# Altium schematic sheet AMC_FMC_Carrier.SchDoc: AMC FMC Carrier v4
size 420 x 297 mm; Organization: WUT ISE; Address1: Warsaw University of Technology; Address2: Nowowiejska 15/19 00-665 Warsaw; Address3: t.przywozki@gmail.com; DocumentNumber: 1; Revision: 1; SheetNumber: 1; SheetTotal: 29; Project: AMC_FMC_Carrier v4.0.2; ModifiedBy: M. Biernat; CreateDate: XX/XX/XXXX; CheckedDate: -; Title2: Top; DivGrp: ISE; Designer: T.Przywozki
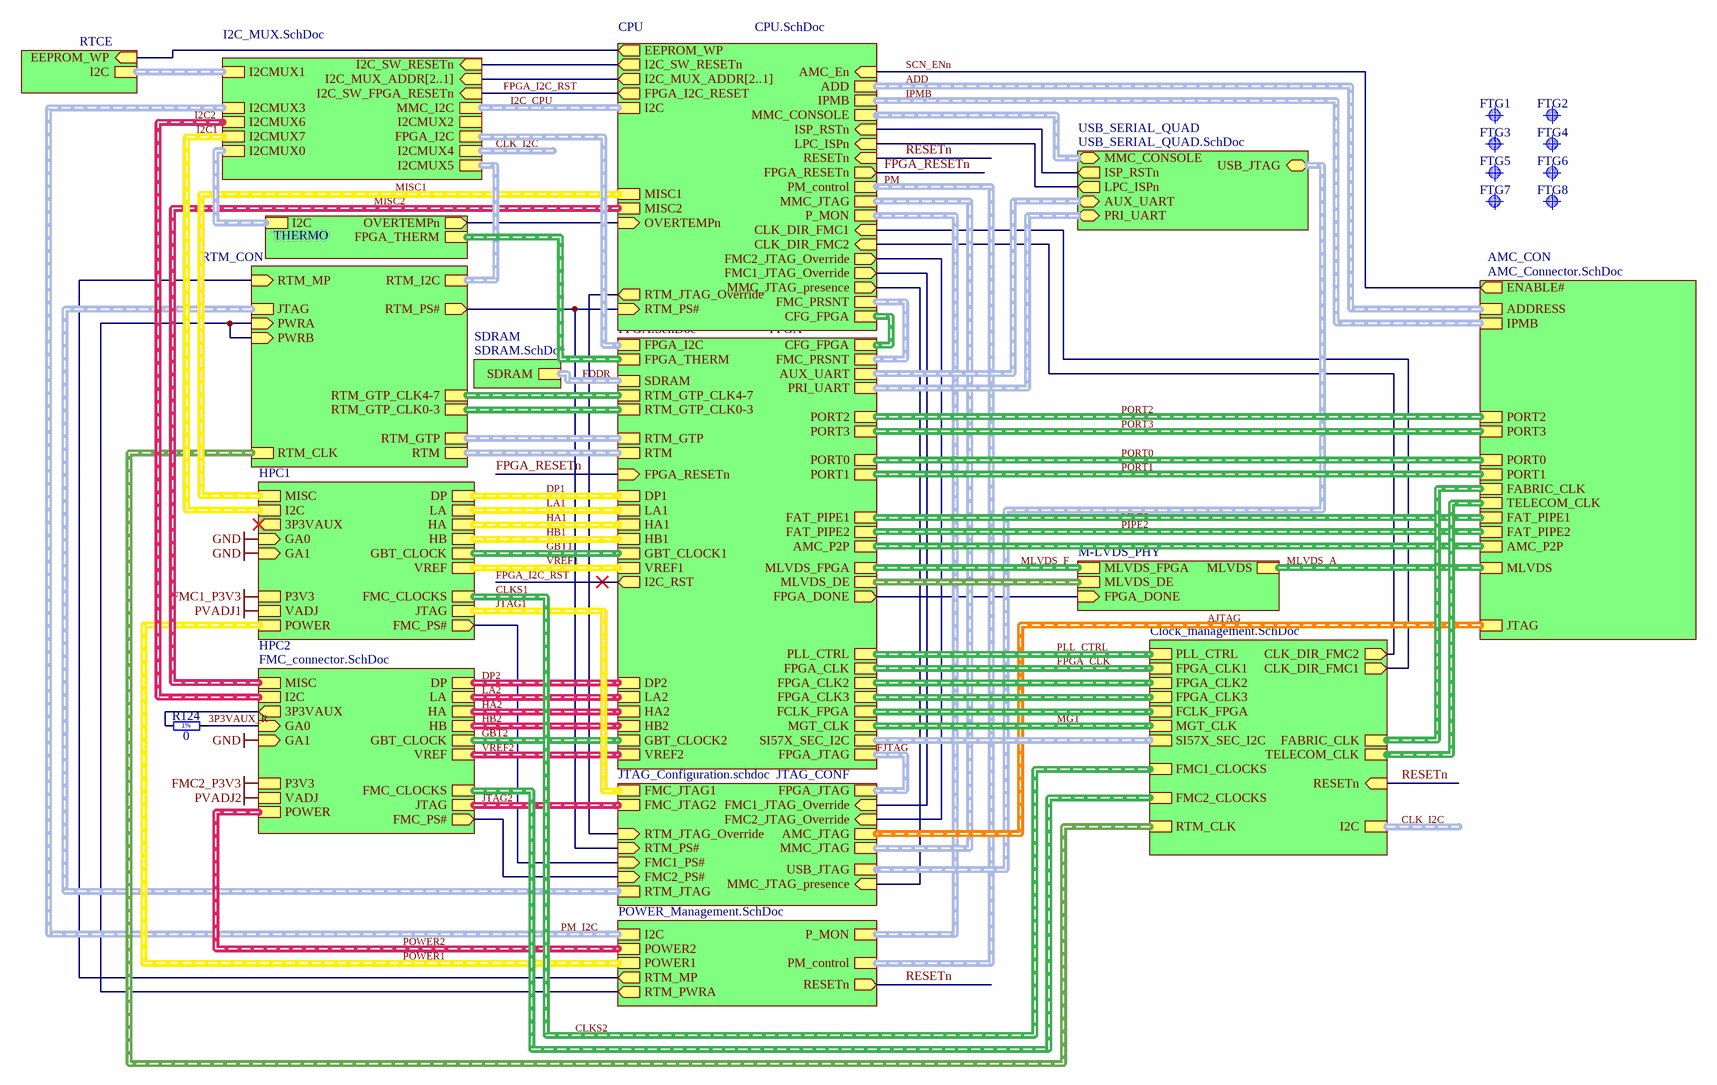
[diagram p0: AMC_FMC_Carrier.SchDoc]

## Parts
FTG1  Use only in PCB  [FIDUCIAL_TOP_S100-200]  (value not drawn)  (no BOM)
FTG2  Use only in PCB  [FIDUCIAL_TOP_C100-200]  (value not drawn)  (no BOM)
FTG3  Use only in PCB  [FIDUCIAL_TOP_S100-200]  (value not drawn)  (no BOM)
FTG4  Use only in PCB  [FIDUCIAL_TOP_C100-200]  (value not drawn)  (no BOM)
FTG5  Use only in PCB  [FIDUCIAL_TOP_S100-200]  (value not drawn)  (no BOM)
FTG6  Use only in PCB  [FIDUCIAL_TOP_C100-200]  (value not drawn)  (no BOM)
FTG7  Use only in PCB  [FIDUCIAL_TOP_S100-200]  (value not drawn)  (no BOM)
FTG8  Use only in PCB  [FIDUCIAL_TOP_C100-200]  (value not drawn)  (no BOM)
R124  0  [RESC1005X40N]

## Sub-sheets
AMC_CON = AMC_Connector.SchDoc: JTAG (harness AMC_JTAG), TELECOM_CLK (harness AMC_TELECOM_CLOCK), ADDRESS (harness AMC_ADD), FABRIC_CLK (harness AMC_FABRIC_CLOCK), IPMB (harness I2C), ENABLE# (out), PORT0 (harness PORT0), PORT1 (harness PORT1), PORT2 (harness PORT2), PORT3 (harness PORT3), FAT_PIPE1 (harness FAT_PIPE1), FAT_PIPE2 (harness FAT_PIPE2), MLVDS (harness MLVDS), AMC_P2P (harness AMC_P2P)
CLK_MGT = Clock_management.SchDoc: FABRIC_CLK (harness AMC_FABRIC_CLOCK), TELECOM_CLK (harness AMC_TELECOM_CLOCK), FMC1_CLOCKS (harness FMC_CLOCKS), FMC2_CLOCKS (harness FMC_CLOCKS), MGT_CLK (harness MGT_CLK), FPGA_CLK1 (harness FPGA_SDRAM_CLK), PLL_CTRL (harness PLL_CTRL), RESETn (in), I2C (harness I2C), SI57X_SEC_I2C (harness SI57X_SEC_I2C), RTM_CLK (harness RTM_CLK), FPGA_CLK2 (harness FPGA_CLK), FPGA_CLK3 (harness FPGA_CLK), CLK_DIR_FMC2 (out), CLK_DIR_FMC1 (out), FCLK_FPGA (harness FPGA_CLK)
CPU = CPU.SchDoc: AMC_En (in), PM_control (harness PM_control), OVERTEMPn (in), CFG_FPGA (harness FPGA_CFG), RESETn (in), I2C (harness I2C), IPMB (harness I2C), MISC1 (harness MISC), MISC2 (harness MISC), ADD (harness AMC_ADD), FPGA_RESETn (out), RTM_PS# (in), I2C_SW_RESETn (out), RTM_JTAG_Override (out), FMC1_JTAG_Override (out), FMC2_JTAG_Override (out), MMC_JTAG (harness JTAG), ISP_RSTn (in), LPC_ISPn (in), MMC_CONSOLE (harness UART), I2C_MUX_ADDR[2..1] (out), P_MON (harness P_MON), EEPROM_WP (out), FMC_PRSNT (harness FMC_PRSNT), FPGA_I2C_RESET (out), CLK_DIR_FMC2 (in), CLK_DIR_FMC1 (in), MMC_JTAG_presence (out)
FPGA = FPGA.SchDoc: SDRAM (harness DDR), FPGA_JTAG (harness JTAG), VREF2 (harness FMC_J1_VREF), VREF1 (harness FMC_J1_VREF), FPGA_THERM (harness FPGA_THERM), CFG_FPGA (harness FPGA_CFG), FAT_PIPE1, FAT_PIPE2, PORT1 (harness PORT1), PORT0 (harness PORT0), MLVDS_FPGA (harness MLVDS-FPGA), GBT_CLOCK1, GBT_CLOCK2, MGT_CLK, FPGA_CLK, PLL_CTRL (harness PLL_CTRL), FPGA_RESETn (in), LA1, HA1, HB1, LA2, HA2, HB2, DP1, DP2, PORT2 (harness PORT2), PORT3 (harness PORT3), RTM_GTP (harness RTM_GTP), RTM_GTP_CLK4-7 (harness CLK_DIFF), RTM_GTP_CLK0-3 (harness CLK_DIFF), AMC_P2P (harness AMC_P2P), FPGA_I2C (harness I2C), SI57X_SEC_I2C (harness SI57X_SEC_I2C), PRI_UART (harness UART), RTM (harness RTM), I2C_RST (out), AUX_UART (harness UART), FPGA_DONE (out), FPGA_CLK2 (harness FPGA_CLK), FPGA_CLK3 (harness FPGA_CLK), FMC_PRSNT (harness FMC_PRSNT), MLVDS_DE (harness MLVDS_DE), FCLK_FPGA (harness FPGA_CLK)
HPC1 = FMC_connector.SchDoc: DP (harness FMC_J1_DP), LA (harness FMC_J1_LA), HA (harness FMC_J1_HA), HB (harness FMC_J1_HB), MISC (harness MISC), POWER (harness FMC_J1_POWER), JTAG (harness JTAG), I2C (harness I2C), GA0 (in), GA1 (in), 3P3VAUX (out), VREF (harness FMC_J1_VREF), FMC_CLOCKS (harness FMC_CLOCKS), GBT_CLOCK (harness GBT_CLOCK), VADJ, P3V3, FMC_PS# (out)
HPC2 = FMC_connector.SchDoc: DP (harness FMC_J1_DP), LA (harness FMC_J1_LA), HA (harness FMC_J1_HA), HB (harness FMC_J1_HB), MISC (harness MISC), POWER (harness FMC_J1_POWER), JTAG (harness JTAG), I2C (harness I2C), VREF (harness FMC_J1_VREF), GA0 (in), GA1 (in), 3P3VAUX (out), FMC_CLOCKS (harness FMC_CLOCKS), GBT_CLOCK (harness GBT_CLOCK), VADJ, P3V3, FMC_PS# (out)
I2C_MUX = I2C_MUX.SchDoc: I2CMUX0 (harness I2C), I2CMUX1 (harness I2C), I2CMUX3 (harness I2C), I2CMUX4 (harness I2C), I2C_SW_RESETn (in), MMC_I2C (harness I2C), I2CMUX7 (harness I2C), I2CMUX6 (harness I2C), I2CMUX5 (harness I2C), FPGA_I2C (harness I2C), I2C_MUX_ADDR[2..1] (in), I2C_SW_FPGA_RESETn (in), I2CMUX2 (harness I2C)
JTAG_CONF = JTAG_Configuration.schdoc: FMC_JTAG1 (harness JTAG), FMC_JTAG2 (harness JTAG), AMC_JTAG (harness AMC_JTAG), FPGA_JTAG (harness JTAG), RTM_JTAG (harness JTAG), FMC1_PS# (in), FMC2_PS# (in), MMC_JTAG (harness JTAG), USB_JTAG (harness USB_JTAG), RTM_PS# (in), RTM_JTAG_Override (in), FMC2_JTAG_Override (in), FMC1_JTAG_Override (in), MMC_JTAG_presence (in)
M-LVDS_PHY = M-LVDS PHY.SchDoc: MLVDS (harness MLVDS), MLVDS_FPGA (harness MLVDS-FPGA), FPGA_DONE (in), MLVDS_DE (harness MLVDS_DE)
PWR_MGT = POWER_Management.SchDoc: POWER1 (harness FMC_J1_POWER), POWER2 (harness FMC_J1_POWER), PM_control (harness PM_control), RESETn (out), I2C (harness I2C), RTM_MP (out), RTM_PWRA (out), P_MON (harness P_MON)
RTCE = RTCE.SchDoc: I2C (harness I2C), EEPROM_WP (in)
RTM_CON = RTM_CON.SchDoc: PWRA (in), PWRB (in), RTM_PS# (out), RTM_MP (in), RTM_GTP (harness RTM_GTP), JTAG (harness JTAG), RTM_GTP_CLK4-7 (harness CLK_DIFF), RTM_GTP_CLK0-3 (harness CLK_DIFF), RTM_CLK (harness RTM_CLK), RTM (harness RTM), RTM_I2C (harness I2C)
SDRAM = SDRAM.SchDoc: SDRAM (harness DDR)
THERMO = Thermometers.SchDoc: OVERTEMPn (out), FPGA_THERM (harness FPGA_THERM), I2C (harness I2C)
USB_SERIAL_QUAD = USB_SERIAL_QUAD.SchDoc: PRI_UART (bidir, harness UART), AUX_UART (bidir, harness UART), ISP_RSTn (out), LPC_ISPn (out), MMC_CONSOLE (bidir, harness UART), USB_JTAG (bidir, harness USB_JTAG)

## Nets
FMC1_P3V3: sheet HPC1/P3V3
FMC2_P3V3: sheet HPC2/P3V3
GND: sheet HPC1/GA0, sheet HPC1/GA1, sheet HPC2/GA1
PVADJ1: sheet HPC1/VADJ
PVADJ2: sheet HPC2/VADJ
3P3VAUX_R: R124.2 ; sheet HPC2/GA0
FPGA_I2C_RST: sheet FPGA/I2C_RST, sheet I2C_MUX/I2C_SW_FPGA_RESETn, sheet CPU/FPGA_I2C_RESET
FPGA_RESETn: sheet FPGA/FPGA_RESETn, sheet CPU/FPGA_RESETn
RESETn: sheet PWR_MGT/RESETn, sheet CLK_MGT/RESETn, sheet CPU/RESETn
SCN_ENn: sheet AMC_CON/ENABLE#, sheet CPU/AMC_En
NetR124_1: R124.1 ; sheet HPC2/3P3VAUX
(unnamed): sheet HPC1/FMC_PS#, sheet JTAG_CONF/FMC1_PS#
(unnamed): sheet HPC2/FMC_PS#, sheet JTAG_CONF/FMC2_PS#
(unnamed): sheet FPGA/FPGA_DONE, sheet M-LVDS_PHY/FPGA_DONE
(unnamed): sheet PWR_MGT/RTM_MP, sheet RTM_CON/RTM_MP
(unnamed): sheet PWR_MGT/RTM_PWRA, sheet RTM_CON/PWRA, sheet RTM_CON/PWRB
(unnamed): sheet JTAG_CONF/RTM_PS#, sheet RTM_CON/RTM_PS#, sheet CPU/RTM_PS#
(unnamed): sheet JTAG_CONF/RTM_JTAG_Override, sheet CPU/RTM_JTAG_Override
(unnamed): sheet JTAG_CONF/FMC2_JTAG_Override, sheet CPU/FMC2_JTAG_Override
(unnamed): sheet JTAG_CONF/FMC1_JTAG_Override, sheet CPU/FMC1_JTAG_Override
(unnamed): sheet JTAG_CONF/MMC_JTAG_presence, sheet CPU/MMC_JTAG_presence
(unnamed): sheet CLK_MGT/CLK_DIR_FMC2, sheet CPU/CLK_DIR_FMC2
(unnamed): sheet CLK_MGT/CLK_DIR_FMC1, sheet CPU/CLK_DIR_FMC1
(unnamed): sheet USB_SERIAL_QUAD/ISP_RSTn, sheet CPU/ISP_RSTn
(unnamed): sheet USB_SERIAL_QUAD/LPC_ISPn, sheet CPU/LPC_ISPn
(unnamed): sheet I2C_MUX/I2C_SW_RESETn, sheet CPU/I2C_SW_RESETn
(unnamed): sheet THERMO/OVERTEMPn, sheet CPU/OVERTEMPn
(unnamed): sheet RTCE/EEPROM_WP, sheet CPU/EEPROM_WP

## Buses and harness runs
bus sheet CPU/I2C_MUX_ADDR[2..1] = sheet I2C_MUX/I2C_MUX_ADDR[2..1]
harness ADD = sheet AMC_CON/ADDRESS = sheet CPU/ADD
harness AJTAG = sheet AMC_CON/JTAG = sheet JTAG_CONF/AMC_JTAG
harness CLK_I2C = sheet CLK_MGT/I2C
harness CLK_I2C = sheet I2C_MUX/I2CMUX4
harness CLKS1 = CLKS2 = sheet CLK_MGT/FMC1_CLOCKS = sheet HPC1/FMC_CLOCKS
harness DP1 = sheet FPGA/DP1 = sheet HPC1/DP
harness DP2 = sheet FPGA/DP2 = sheet HPC2/DP
harness FDDR = sheet FPGA/SDRAM = sheet SDRAM/SDRAM
harness FJTAG = sheet FPGA/FPGA_JTAG = sheet JTAG_CONF/FPGA_JTAG
harness FPGA_CLK = sheet CLK_MGT/FPGA_CLK1 = sheet FPGA/FPGA_CLK
harness GBT1 = sheet FPGA/GBT_CLOCK1 = sheet HPC1/GBT_CLOCK
harness GBT2 = sheet FPGA/GBT_CLOCK2 = sheet HPC2/GBT_CLOCK
harness HA1 = sheet FPGA/HA1 = sheet HPC1/HA
harness HA2 = sheet FPGA/HA2 = sheet HPC2/HA
harness HB1 = sheet FPGA/HB1 = sheet HPC1/HB
harness HB2 = sheet FPGA/HB2 = sheet HPC2/HB
harness I2C1 = sheet HPC1/I2C = sheet I2C_MUX/I2CMUX7
harness I2C2 = sheet HPC2/I2C = sheet I2C_MUX/I2CMUX6
harness I2C_CPU = sheet CPU/I2C = sheet I2C_MUX/MMC_I2C
harness IPMB = sheet AMC_CON/IPMB = sheet CPU/IPMB
harness JTAG1 = sheet HPC1/JTAG = sheet JTAG_CONF/FMC_JTAG1
harness JTAG2 = sheet HPC2/JTAG = sheet JTAG_CONF/FMC_JTAG2
harness LA1 = sheet FPGA/LA1 = sheet HPC1/LA
harness LA2 = sheet FPGA/LA2 = sheet HPC2/LA
harness MGT = sheet CLK_MGT/MGT_CLK = sheet FPGA/MGT_CLK
harness MISC1 = sheet CPU/MISC1 = sheet HPC1/MISC
harness MISC2 = sheet CPU/MISC2 = sheet HPC2/MISC
harness MLVDS_A = sheet AMC_CON/MLVDS = sheet M-LVDS_PHY/MLVDS
harness MLVDS_F = sheet FPGA/MLVDS_FPGA = sheet M-LVDS_PHY/MLVDS_FPGA
harness PIPE1 = sheet AMC_CON/FAT_PIPE1 = sheet FPGA/FAT_PIPE1
harness PIPE2 = sheet AMC_CON/FAT_PIPE2 = sheet FPGA/FAT_PIPE2
harness PLL_CTRL = sheet CLK_MGT/PLL_CTRL = sheet FPGA/PLL_CTRL
harness PM = sheet CPU/PM_control = sheet PWR_MGT/PM_control
harness PM_I2C = sheet I2C_MUX/I2CMUX3 = sheet PWR_MGT/I2C
harness PORT0 = sheet AMC_CON/PORT0 = sheet FPGA/PORT0
harness PORT1 = sheet AMC_CON/PORT1 = sheet FPGA/PORT1
harness PORT2 = sheet AMC_CON/PORT2 = sheet FPGA/PORT2
harness PORT3 = sheet AMC_CON/PORT3 = sheet FPGA/PORT3
harness POWER1 = sheet HPC1/POWER = sheet PWR_MGT/POWER1
harness POWER2 = sheet HPC2/POWER = sheet PWR_MGT/POWER2
harness sheet AMC_CON/AMC_P2P = sheet FPGA/AMC_P2P
harness sheet AMC_CON/FABRIC_CLK = sheet CLK_MGT/FABRIC_CLK
harness sheet AMC_CON/TELECOM_CLK = sheet CLK_MGT/TELECOM_CLK
harness sheet CLK_MGT/FCLK_FPGA = sheet FPGA/FCLK_FPGA
harness sheet CLK_MGT/FMC2_CLOCKS = sheet HPC2/FMC_CLOCKS
harness sheet CLK_MGT/FPGA_CLK2 = sheet FPGA/FPGA_CLK2
harness sheet CLK_MGT/FPGA_CLK3 = sheet FPGA/FPGA_CLK3
harness sheet CLK_MGT/RTM_CLK = sheet RTM_CON/RTM_CLK
harness sheet CLK_MGT/SI57X_SEC_I2C = sheet FPGA/SI57X_SEC_I2C
harness sheet CPU/CFG_FPGA = sheet FPGA/CFG_FPGA
harness sheet CPU/FMC_PRSNT = sheet FPGA/FMC_PRSNT
harness sheet CPU/MMC_CONSOLE = sheet USB_SERIAL_QUAD/MMC_CONSOLE
harness sheet CPU/MMC_JTAG = sheet JTAG_CONF/MMC_JTAG
harness sheet CPU/P_MON = sheet PWR_MGT/P_MON
harness sheet FPGA/AUX_UART = sheet USB_SERIAL_QUAD/AUX_UART
harness sheet FPGA/FPGA_I2C = sheet I2C_MUX/FPGA_I2C
harness sheet FPGA/FPGA_THERM = sheet THERMO/FPGA_THERM
harness sheet FPGA/MLVDS_DE = sheet M-LVDS_PHY/MLVDS_DE
harness sheet FPGA/PRI_UART = sheet USB_SERIAL_QUAD/PRI_UART
harness sheet FPGA/RTM = sheet RTM_CON/RTM
harness sheet FPGA/RTM_GTP = sheet RTM_CON/RTM_GTP
harness sheet FPGA/RTM_GTP_CLK0-3 = sheet RTM_CON/RTM_GTP_CLK0-3
harness sheet FPGA/RTM_GTP_CLK4-7 = sheet RTM_CON/RTM_GTP_CLK4-7
harness sheet I2C_MUX/I2CMUX0 = sheet THERMO/I2C
harness sheet I2C_MUX/I2CMUX1 = sheet RTCE/I2C
harness sheet I2C_MUX/I2CMUX5 = sheet RTM_CON/RTM_I2C
harness sheet JTAG_CONF/RTM_JTAG = sheet RTM_CON/JTAG
harness sheet JTAG_CONF/USB_JTAG = sheet USB_SERIAL_QUAD/USB_JTAG
harness VREF1 = sheet FPGA/VREF1 = sheet HPC1/VREF
harness VREF2 = sheet FPGA/VREF2 = sheet HPC2/VREF

## Notes on the sheet
- Project/Equipment
- Document
- Designer
- Drawn by
- Check.by
- Copyright CNPEM 2013, WUT ISE 2020
  This documentation describes Open Hardware and is licensed under CERN OHL v.1.1. You may redistribute and modify this documentaction under the terms of the CERN OHL v1.1.
  (http://ohwr.org/CERNOHL). This documentation is dristributed WITHOUT ANY EXPRESS OR IMPLIED WARRANTY, INCLUDING OF MERCHANTABLITY, SATISFACTORY QUALITY AND FITNESS FOR A PARTICULAR PURPOSE. Please see the CERN OHL v.1.1 for applicable conditions
- File
- Last Mod.
- Print Date
- Sheet
- Size
- A3
- of
- Rev
- Contact:
- (in symbol R0402_0R_JUMPER) 1%

## Library data of the parts
FTG1 FTG3 FTG5 FTG7 = FIDUCIAL_TARGET_S100-200: Fiducial Target; Part Description: Square Fiducial Target, Top Layer, 1.0mm, Top Solder 2.0mm, Keepout =2.0mm; Mounted: No; Table: Pads; Part Number: FIDUCIAL_TARGET_S100-200; Component Type: Standard (No BOM); Pin Count: 1; Family: Fiducial; Socket: No; SMD: Yes; Status: None; ComponentHeight: 0mm; Author: CERN DEM JLC; CreateDate: 2010-02-09; LatestRevisionDate: 2012-04-04; PackageDescription: Square Fiducial Target, Top Layer, 1.0mm, Top Solder 2.0mm, Keepout =2.0mm
FTG2 FTG4 FTG6 FTG8 = FIDUCIAL_TARGET_C100-200: Fiducial Target; Part Description: Round Fiducial Target, Top Layer, 1.0mm, Top Solder 2.0mm, Keepout =2.0mm; Mounted: No; Table: Pads; Part Number: FIDUCIAL_TARGET_C100-200; Component Type: Standard (No BOM); Pin Count: 1; Family: Fiducial; Socket: No; SMD: Yes; Status: None; ComponentHeight: 0mm; Author: CERN DEM JLC; CreateDate: 2010-02-09; LatestRevisionDate: 2012-04-04; PackageDescription: Round Fiducial Target, Top Layer, 1.0mm, Top Solder 2.0mm, Keepout =2.0mm
R124 = R0402_0R_JUMPER: Resistor - 1%; Part Description: 1A (0.05R Max DC Resistance) Zero Ohm Jumper; Manufacturer: GENERIC; Manufacturer1 Part Number: 232270591001L; Table: Resistors SMD; Part Number: R0402_0R_JUMPER; Component Kind: Standard; Component Type: Standard; Pin Count: 2; Value: 0; Status: Not recommended; Manufacturer Part Number: R0402_0R_JUMPER; Case: 0402; Mounted: Yes; Socket: No; SMD: Yes; Manufacturer1 Example: YAGEO PHYCOMP; Manufacturer1 ComponentHeight: 0.4mm; HelpURL: \\cern.ch\dfs\Applications\Altium\Datasheets\R0402_Phycomp_RC0402.pdf; Author: CERN DEM JLC; CreateDate: 2007-12-03; LatestRevisionDate: 2012-10-17